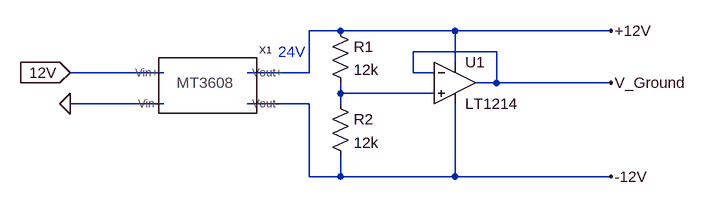
[diagram p0: schematic PowerSupply.asc]
PowerSupply.asc, the LTspice schematic file:
Version 4
SHEET 1 880 680
WIRE 144 0 96 0
WIRE 320 0 144 0
WIRE 560 0 320 0
WIRE 384 32 256 32
WIRE 320 48 320 0
WIRE -128 64 -272 64
WIRE 96 64 96 0
WIRE 96 64 0 64
WIRE 256 64 256 32
WIRE 288 64 256 64
WIRE 384 80 384 32
WIRE 384 80 352 80
WIRE 560 80 384 80
WIRE 144 96 144 80
WIRE 288 96 144 96
WIRE -128 112 -272 112
WIRE 96 112 0 112
WIRE 144 112 144 96
WIRE 96 224 96 112
WIRE 144 224 144 192
WIRE 144 224 96 224
WIRE 320 224 320 112
WIRE 320 224 144 224
WIRE 560 224 320 224
FLAG -272 64 12V
IOPIN -272 64 In
FLAG -272 112 0
FLAG 560 0 +12V
FLAG 560 224 -12V
FLAG 560 80 V_Ground
SYMBOL Opamps\\LT1214 320 16 R0
SYMATTR InstName U1
SYMBOL res 128 -16 R0
SYMATTR InstName R1
SYMATTR Value 12k
SYMBOL res 128 96 R0
SYMATTR InstName R2
SYMATTR Value 12k
SYMBOL MT3608 -64 80 R0
SYMATTR InstName X1
TEXT 48 32 Left 2 ;24V

The netlist it stands for:
* PowerSupply.asc
XU1 N001 V_Ground +12V -12V V_Ground LT1213  ; LT1214, pins In+ In- V+ V- OUT
R1 +12V N001 12k
R2 N001 -12V 12k
XX1 12V 0 +12V -12V MT3608  ; pins Vin+ Vin- Vout+ Vout-
* 24V
.lib LTC.lib
.backanno
.end